# Altium schematic sheet UBT.SchDoc
size A1
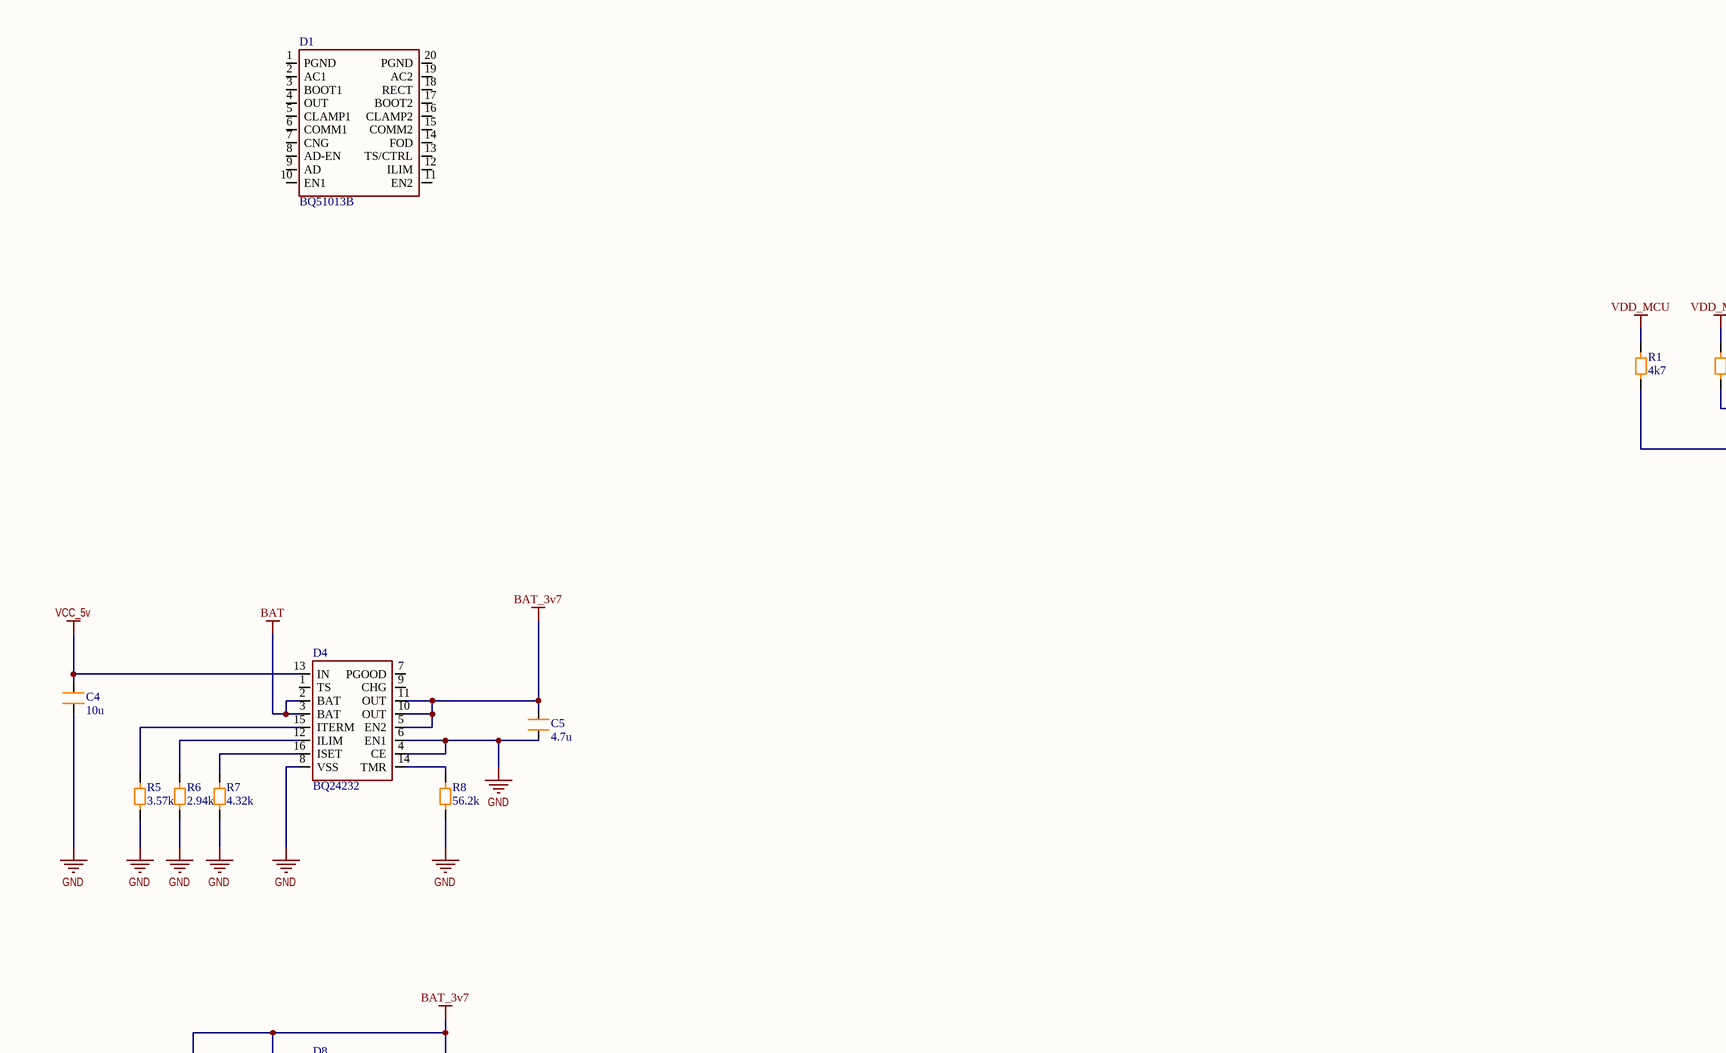
[diagram p0: UBT.SchDoc, top left]
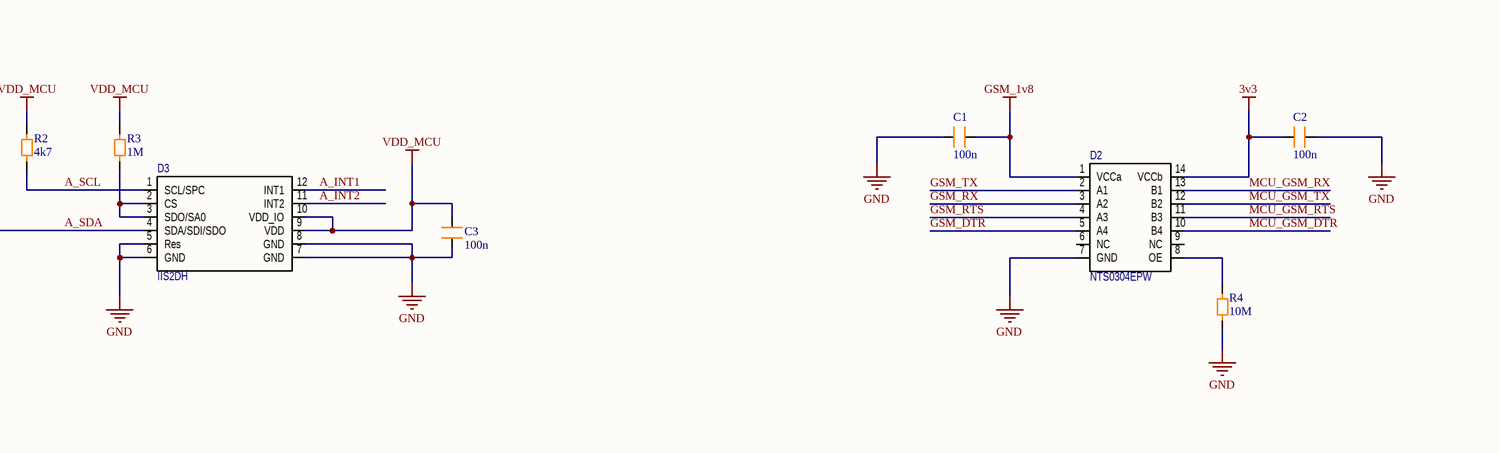
[diagram p1: UBT.SchDoc, top right]
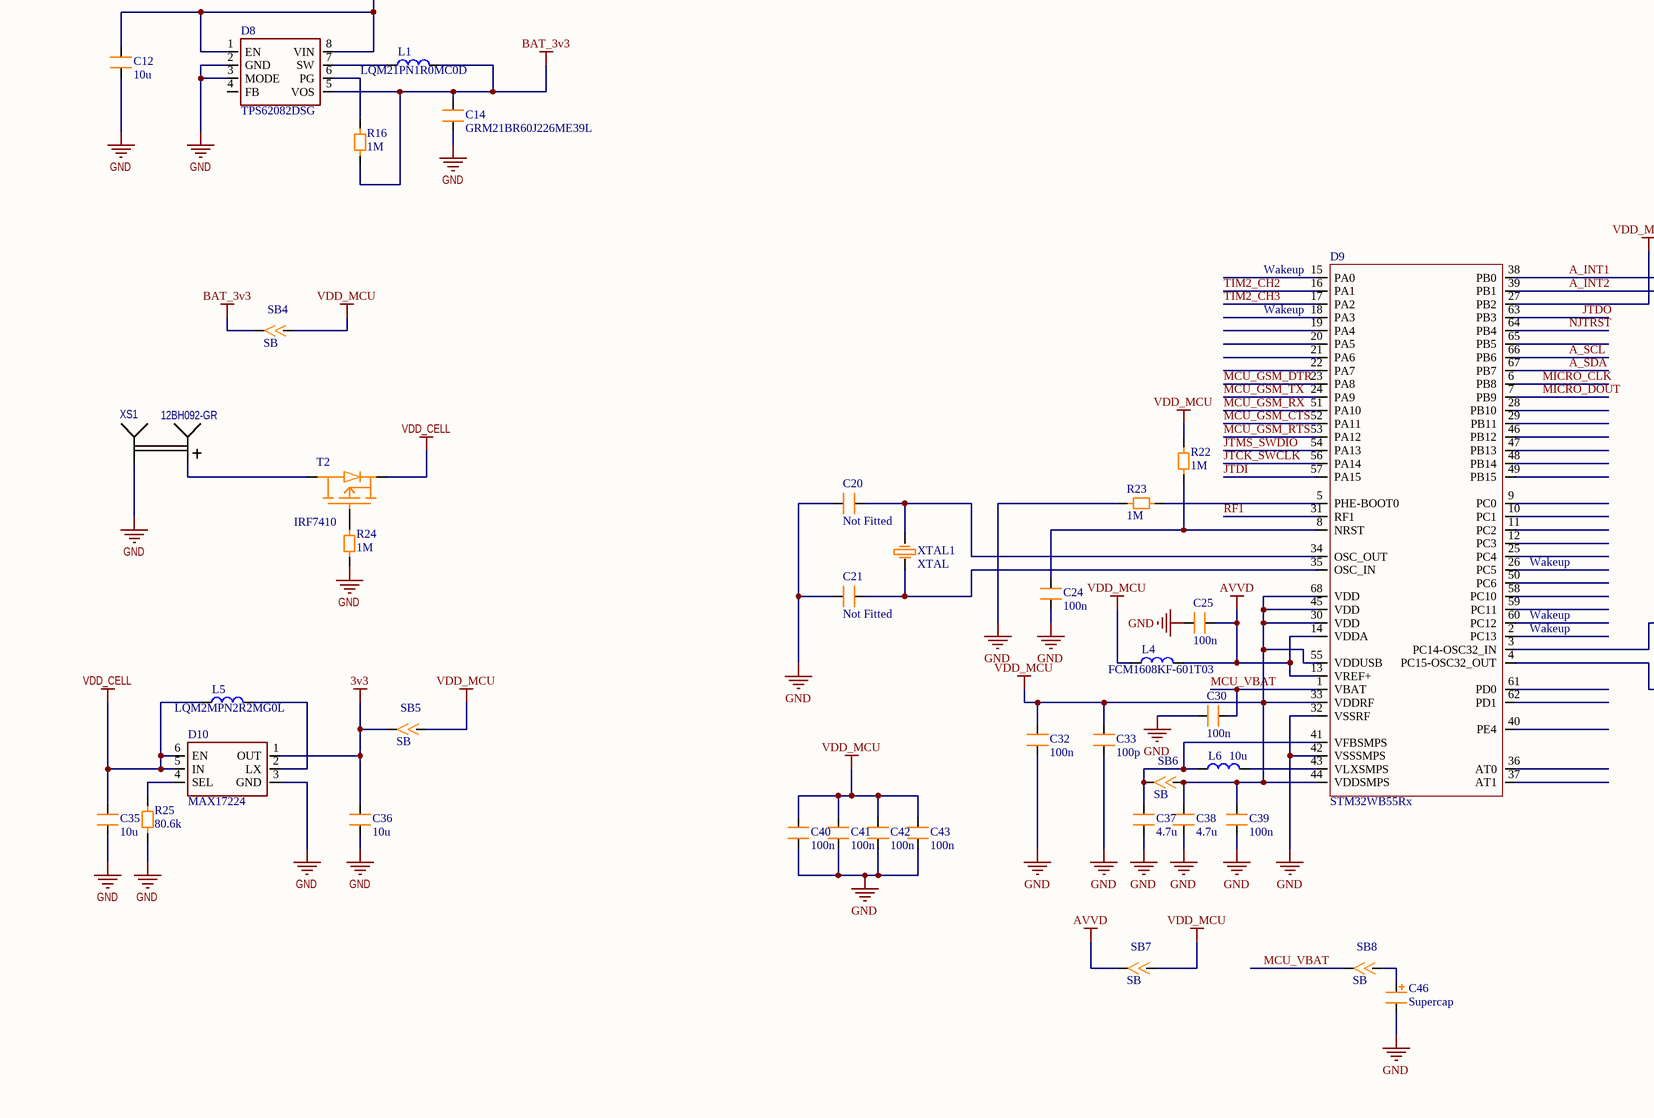
[diagram p2: UBT.SchDoc, bottom left]
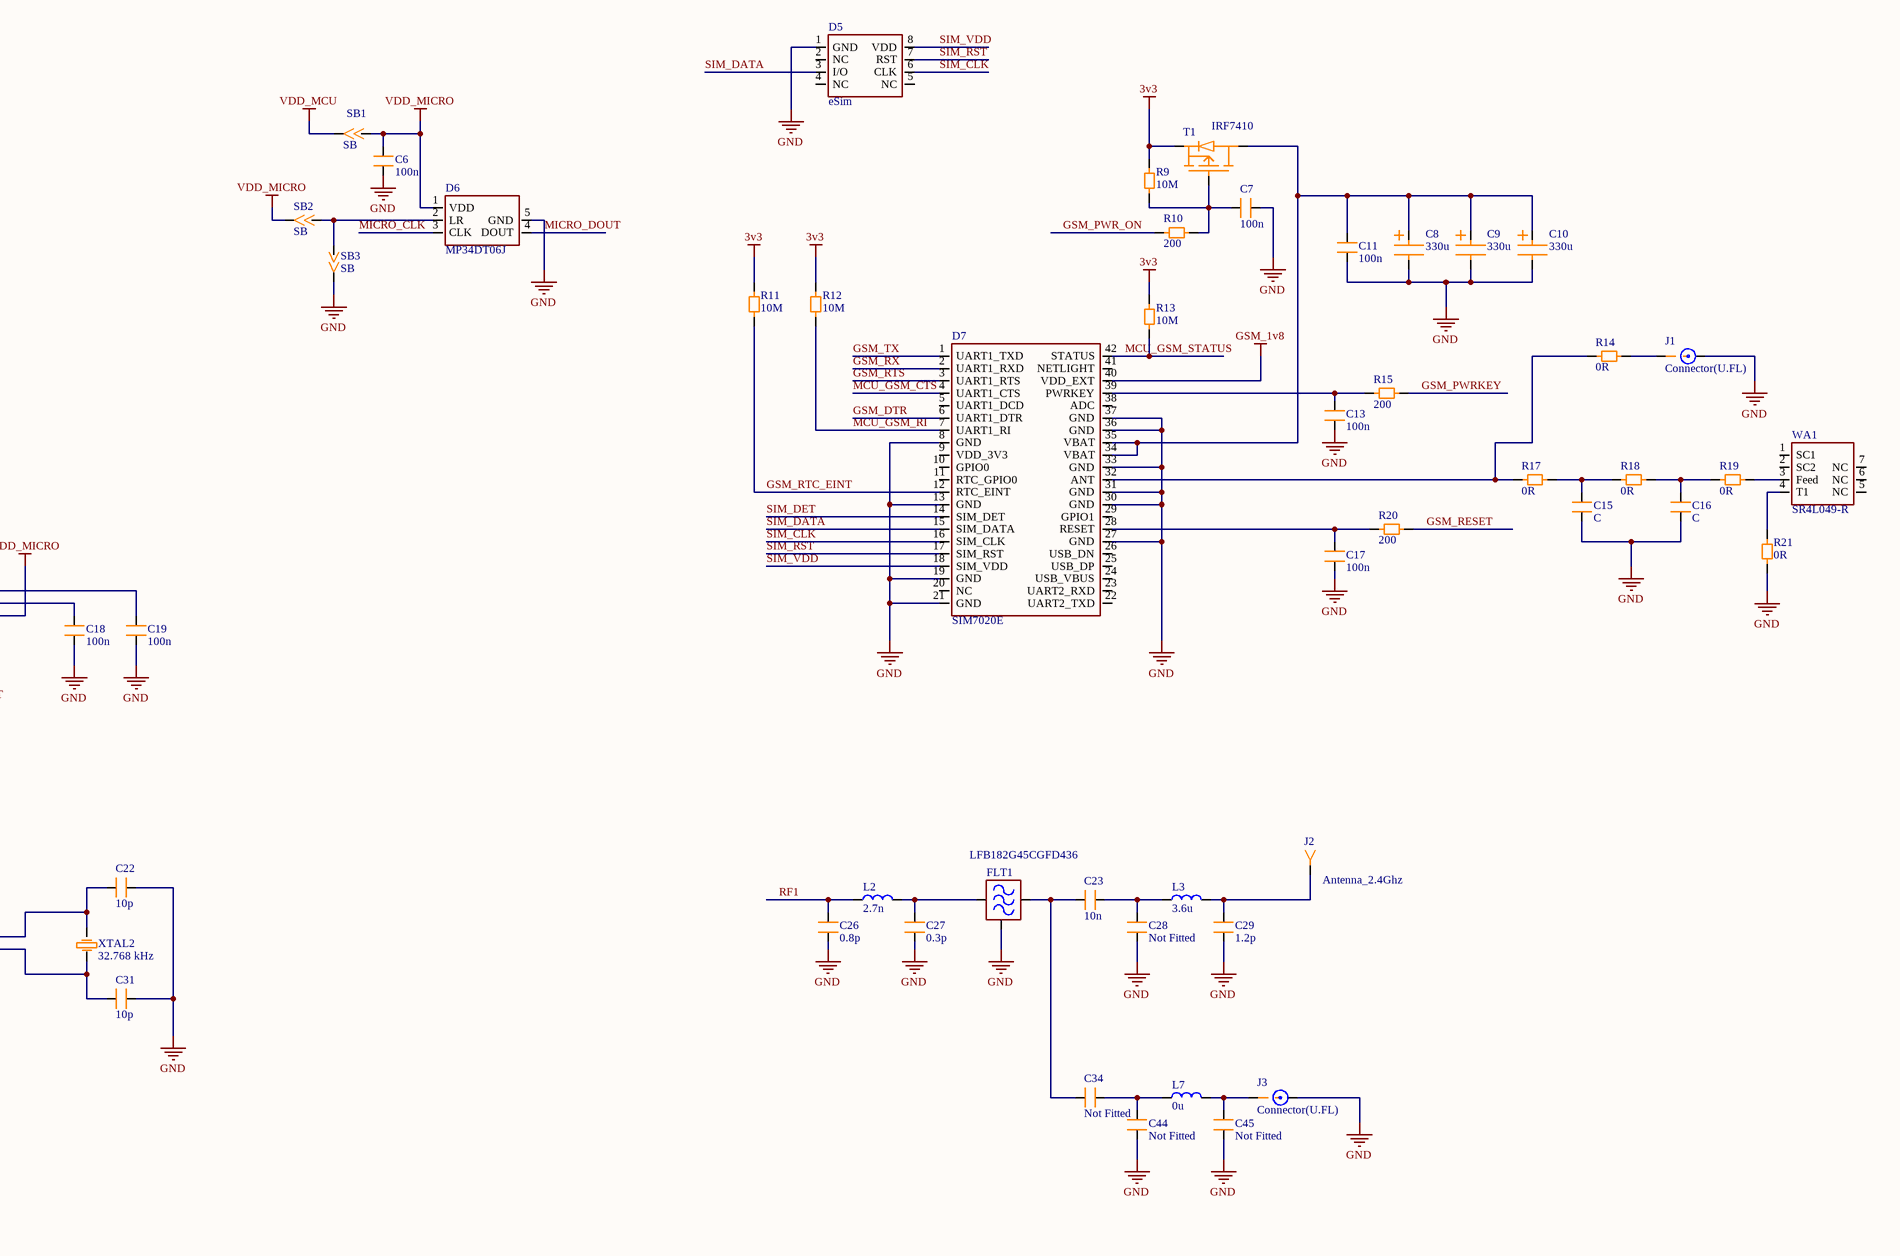
[diagram p3: UBT.SchDoc, bottom right]

## Parts
C1  100n  [C0402]
C2  100n  [C0402]
C3  100n  [C0402]
C4  10u  [C0603]
C5  4.7u  [C0603]
C6  100n  [C0402]
C7  100n  [C0402]
C8  330u  [C_TYPE_D]
C9  330u  [C_TYPE_D]
C10  330u  [C_TYPE_D]
C11  100n  [C0402]
C12  10u  [C0603]
C13  100n  [C0402]
C14  GRM21BR60J226ME39L  [C0805]
C15  C  [C0402]
C16  C  [C0402]
C17  100n  [C0402]
C18  100n  [C0402]
C19  100n  [C0402]
C20  Not Fitted  [C0402]
C21  Not Fitted  [C0402]
C22  10p  [C0402]
C23  10n  [C0402]
C24  100n  [C0402]
C25  100n  [C0402]
C26  0.8p  [C0402]
C27  0.3p  [C0402]
C28  Not Fitted  [C0402]
C29  1.2p  [C0402]
C30  100n  [C0402]
C31  10p  [C0402]
C32  100n  [C0402]
C33  100p  [C0402]
C34  Not Fitted  [C0402]
C35  10u  [C0603]
C36  10u  [C0603]
C37  4.7u  [C0402]
C38  4.7u  [C0402]
C39  100n  [C0402]
C40  100n  [C0402]
C41  100n  [C0402]
C42  100n  [C0402]
C43  100n  [C0402]
C44  Not Fitted  [C0402]
C45  Not Fitted  [C0402]
C46  Supercap  [Supercap_5mm]
D1  BQ51013B  [VQFN20]
D2  NTS0304EPW  [TSSOP14]
D3  IIS2DH  [LGA12]
D4  BQ24232  [VQFN-16]
D5  eSim  [VQFN8]
D6  MP34DT06J  [MP34DT06J]
D7  SIM7020E  [SIM7020E]
D8  TPS62082DSG  [WSON8]
D9  STM32WB55Rx  [VFQFPN68]
D10  MAX17224
FLT1  LFB182G45CGFD436  [LFB182G45CGFD436]
J1  Connector(U.FL)  [U.FL]
J2  Antenna_2.4Ghz  [Antenna_2.4Ghz]
J3  Connector(U.FL)  [U.FL]
L1  LQM21PN1R0MC0D  [L0805]
L2  2.7n  [L0402]
L3  3.6u  [L0402]
L4  FCM1608KF-601T03  [L1608]
L5  LQM2MPN2R2MG0L  [L2016]
L6  10u  [L0805]
L7  0u  [L0402]
R1  4k7  [R0402]
R2  4k7  [R0402]
R3  1M  [R0402]
R4  10M  [R0402]
R5  3.57k  [R0402]
R6  2.94k  [R0402]
R7  4.32k  [R0402]
R8  56.2k  [R0402]
R9  10M  [R0402]
R10  200  [R0402]
R11  10M  [R0402]
R12  10M  [R0402]
R13  10M  [R0402]
R14  0R  [R0402]
R15  200  [R0402]
R16  1M  [R0402]
R17  0R  [R0402]
R18  0R  [R0402]
R19  0R  [R0402]
R20  200  [R0402]
R21  0R  [R0402]
R22  1M  [R0402]
R23  1M  [R0402]
R24  1M  [R0402]
R25  80.6k  [R0402]
SB1  SB  [SB]
SB2  SB  [SB]
SB3  SB  [SB]
SB4  SB  [SB]
SB5  SB  [SB]
SB6  SB  [SB]
SB7  SB  [SB]
SB8  SB  [SB]
T1  IRF7410  [SO8]
T2  IRF7410  [SO8]
WA1  SR4L049-R  [SR4L049-R]
XS1  12BH092-GR  [12BH092-GR]
XTAL1  XTAL  [NX2016SA]
XTAL2  32.768 kHz  [NX2012SA]

## Nets
3v3: C2.1 C36.2 D2.14(VCCb) D10.1(OUT) R9.1 R11.1 R12.1 R13.1 SB5.1 T1.1
AVVD: C25.1 D9.13(VREF+) D9.14(VDDA) L4.2 SB7.1
BAT: D4.2(BAT) D4.3(BAT)
BAT_3v3: C14.2 D8.5(VOS) L1.2 R16.1 SB4.1
BAT_3v7: C5.2 C12.2 D4.5(EN2) D4.10(OUT) D4.11(OUT) D8.1(EN) D8.8(VIN)
GSM_1v8: C1.2 D2.1(VCCa) D7.40(VDD_EXT)
MICRO_DOUT: C1.1 C2.2 C3.1 C4.1 C5.1 C6.1 C7.1 C8.2 C9.2 C10.2 C11.1 C12.1 C13.1 C14.1 C15.1 C16.1 C17.1 C18.1 C19.1 C20.2 C21.2 C22.2 C24.1 C25.2 C26.1 C27.1 C28.1 C29.1 C30.2 C31.2 C32.1 C33.1 C35.1 C36.1 C37.1 C38.1 C39.1 C40.1 C41.1 C42.1 C43.1 C44.1 C45.1 C46.2 D2.7(GND) D3.5(Res) D3.6(GND) D3.7(GND) D3.8(GND) D4.4(CE) D4.6(EN1) D4.8(VSS) D5.1(GND) D6.4(DOUT) D6.5(GND) D7.8(GND) D7.13(GND) D7.19(GND) D7.21(GND) D7.27(GND) D7.30(GND) D7.31(GND) D7.33(GND) D7.36(GND) D7.37(GND) D8.2(GND) D8.3(MODE) D9.7(PB9) D9.32(VSSRF) D9.42(VSSSMPS) D10.3(GND) FLT1.2 J1.2 J3.2 R4.2 R5.1 R6.1 R7.1 R8.1 R21.1 R23.2 R24.1 R25.1 SB3.1 XS1.2  [also labelled GND]
VCC_5v: C4.2 D4.13(IN)
VDD_CELL: C35.2 D10.5(IN) D10.6(EN) L5.1 T2.1
VDD_MCU: C3.2 C32.2 C33.2 C38.2 C39.2 C40.2 C41.2 C42.2 C43.2 D3.9(VDD) D3.10(VDD_IO) D9.30(VDD) D9.33(VDDRF) D9.44(VDDSMPS) D9.45(VDD) D9.55(VDDUSB) D9.68(VDD) L4.1 R1.2 R2.2 R3.2 R22.2 SB1.1 SB4.2 SB5.2 SB6.2 SB7.2
VDD_MICRO: C6.2 D6.1(VDD) D9.27(PB2) SB1.2 SB2.1
A_INT1: C19.2 D3.12(INT1) D9.38(PB0)
A_INT2: C18.2 D3.11(INT2) D9.39(PB1)
A_SCL: D3.1(SCL/SPC) D9.66(PB6) R2.1
A_SDA: D3.4(SDA/SDI/SDO) D9.67(PB7) R1.1
GSM_DTR: D2.5(A4) D7.6(UART1_DTR)
GSM_PWR_ON: R10.1
GSM_PWRKEY: R15.2
GSM_RESET: R20.2
GSM_RTC_EINT: D7.12(RTC_EINT) R11.2
GSM_RTS: D2.4(A3) D7.3(UART1_RTS)
GSM_RX: D2.3(A2) D7.2(UART1_RXD)
GSM_TX: D2.2(A1) D7.1(UART1_TXD)
JTCK_SWCLK: D9.56(PA14)
JTDI: D9.57(PA15)
JTDO: D9.63(PB3)
JTMS_SWDIO: D9.54(PA13)
MCU_GSM_CTS: D7.4(UART1_CTS) D9.52(PA11)
MCU_GSM_DTR: D2.10(B4) D9.23(PA8)
MCU_GSM_RI: D7.7(UART1_RI) R12.2
MCU_GSM_RTS: D2.11(B3) D9.53(PA12)
MCU_GSM_RX: D2.13(B1) D9.51(PA10)
MCU_GSM_STATUS: D7.42(STATUS) R13.2
MCU_GSM_TX: D2.12(B2) D9.24(PA9)
MCU_VBAT: C30.1 D9.1(VBAT) SB8.1
MICRO_CLK: D6.3(CLK) D9.6(PB8)
NJTRST: D9.64(PB4)
RF1: C26.2 D9.31(RF1) L2.1
SIM_CLK: D5.6(CLK) D7.16(SIM_CLK)
SIM_DATA: D5.3(I/O) D7.15(SIM_DATA)
SIM_DET: D7.14(SIM_DET)
SIM_RST: D5.7(RST) D7.17(SIM_RST)
SIM_VDD: D5.8(VDD) D7.18(SIM_VDD)
TIM2_CH2: D9.16(PA1)
TIM2_CH3: D9.17(PA2)
NetC7_2: C7.2 R9.2 R10.2 T1.4
NetC8_1: C8.1 C9.1 C10.1 C11.2 D7.34(VBAT) D7.35(VBAT) T1.5
NetC13_2: C13.2 D7.39(PWRKEY) R15.1
NetC15_2: C15.2 R17.2 R18.1
NetC16_2: C16.2 R18.2 R19.1
NetC17_2: C17.2 D7.28(RESET) R20.1
NetC20_1: C20.1 D9.34(OSC_OUT) XTAL1.2
NetC21_1: C21.1 D9.35(OSC_IN) XTAL1.1
NetC22_1: C22.1 D9.3(PC14-OSC32_IN) XTAL2.2
NetC23_1: C23.1 C34.1 FLT1.3
NetC23_2: C23.2 C28.2 L3.1
NetC24_2: C24.2 D9.8(NRST) R22.1
NetC27_2: C27.2 FLT1.1 L2.2
NetC29_2: C29.2 J2.1 L3.2
NetC31_1: C31.1 D9.4(PC15-OSC32_OUT) XTAL2.1
NetC34_2: C34.2 C44.2 L7.1
NetC37_2: C37.2 D9.41(VFBSMPS) L6.1 SB6.1
NetC45_2: C45.2 J3.1 L7.2
NetC46_1: C46.1 SB8.2
NetD2_8: D2.8(OE) R4.1
NetD3_2: D3.2(CS) D3.3(SDO/SA0) R3.1
NetD4_12: D4.12(ILIM) R6.2
NetD4_14: D4.14(TMR) R8.2
NetD4_15: D4.15(ITERM) R5.2
NetD4_16: D4.16(ISET) R7.2
NetD6_2: D6.2(LR) SB2.2 SB3.2
NetD7_32: D7.32(ANT) R14.1 R17.1
NetD8_6: D8.6(PG) R16.2
NetD8_7: D8.7(SW) L1.1
NetD9_5: D9.5(PHE-BOOT0) R23.1
NetD9_43: D9.43(VLXSMPS) L6.2
NetD10_2: D10.2(LX) L5.2
NetD10_4: D10.4(SEL) R25.2
NetJ1_1: J1.1 R14.2
NetR19_2: R19.2 WA1.3(Feed)
NetR21_2: R21.2 WA1.4(T1)
NetR24_2: R24.2 T2.4
NetT2_5: T2.5 XS1.1

Not connected (* = marked no-connect by the designer): D1 1(PGND) 2(AC1) 3(BOOT1) 4(OUT) 5(CLAMP1) 6(COMM1) 7(CNG) 8(AD-EN) 9(AD) 10(EN1) 11(EN2) 12(ILIM) 13(TS/CTRL) 14(FOD) 15(COMM2) 16(CLAMP2) 17(BOOT2) 18(RECT) 19(AC2) 20(PGND); D2 6(NC) 9(NC); D4 1(TS) 7(PGOOD) 9(CHG); D5 2(NC) 4(NC) 5(NC); D7 5(UART1_DCD) 9(VDD_3V3) 10(GPIO0) 11(RTC_GPIO0) 20(NC) 22(UART2_TXD) 23(UART2_RXD) 24(USB_VBUS) 25(USB_DP) 26(USB_DN) 29(GPIO1) 38(ADC) 41(NETLIGHT); D8 4(FB); D9 2(PC13) 9(PC0) 10(PC1) 11(PC2) 12(PC3) 15(PA0) 18(PA3) 19(PA4) 20(PA5) 21(PA6) 22(PA7) 25(PC4) 26(PC5) 28(PB10) 29(PB11) 36(AT0) 37(AT1) 40(PE4) 46(PB12) 47(PB13) 48(PB14) 49(PB15) 50(PC6) 58(PC10) 59(PC11) 60(PC12) 61(PD0) 62(PD1) 65(PB5); WA1 1(SC1) 2(SC2) 5(NC) 6(NC) 7(NC)

## Notes on the sheet
- (near D9) Wakeup

## Library data of the parts
C1-C7 C11-C14 C17-C45 = C
C8-C10 = C_TANTAL
D8 = TPS62081
L1-L7 = L
R1-R25 = R